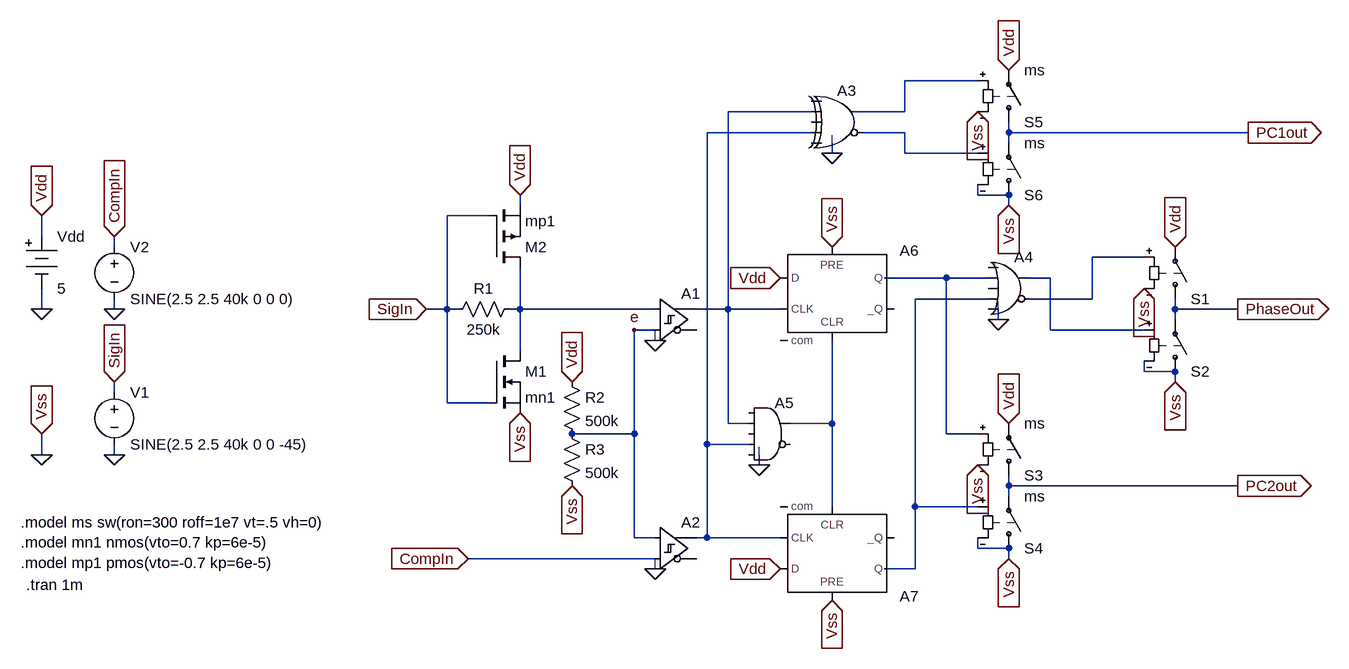
[diagram p0: schematic PhaseComp_Full.asc]
PhaseComp_Full.asc, the LTspice schematic file:
Version 4
SHEET 1 1684 680
WIRE 272 -288 160 -288
WIRE 16 -240 -112 -240
WIRE 160 -240 160 -288
WIRE 160 -240 80 -240
WIRE 16 -208 -144 -208
WIRE 160 -208 96 -208
WIRE 320 -208 320 -224
WIRE 688 -208 320 -208
WIRE 320 -192 320 -208
WIRE 48 -176 48 -192
WIRE 160 -176 160 -208
WIRE 272 -176 160 -176
WIRE 272 -112 272 -128
WIRE 320 -112 272 -112
WIRE -432 -96 -432 -112
WIRE 320 -96 320 -112
WIRE -480 -80 -544 -80
WIRE -1168 -48 -1168 -80
WIRE -1056 -32 -1056 -48
WIRE 528 -16 448 -16
WIRE 224 16 128 16
WIRE 288 16 224 16
WIRE 384 16 352 16
WIRE 288 48 176 48
WIRE 448 48 448 -16
WIRE 448 48 352 48
WIRE -1168 64 -1168 32
WIRE -1056 64 -1056 48
WIRE -544 64 -544 -80
WIRE -544 64 -576 64
WIRE -528 64 -544 64
WIRE -432 64 -432 0
WIRE -432 64 -448 64
WIRE -224 64 -432 64
WIRE -112 64 -112 -240
WIRE -112 64 -160 64
WIRE -32 64 -112 64
WIRE 576 64 576 48
WIRE 672 64 576 64
WIRE 304 80 304 64
WIRE 576 80 576 64
WIRE -224 96 -256 96
WIRE 384 96 384 16
WIRE 528 96 384 96
WIRE -432 128 -432 64
WIRE 528 160 528 144
WIRE 576 160 528 160
WIRE 576 176 576 160
WIRE -1056 192 -1056 176
WIRE -544 208 -544 64
WIRE -480 208 -544 208
WIRE -112 240 -112 64
WIRE -80 240 -112 240
WIRE 48 240 48 112
WIRE 48 240 -16 240
WIRE -256 256 -256 96
WIRE -256 256 -352 256
WIRE 224 256 224 16
WIRE 272 256 224 256
WIRE -144 272 -144 -208
WIRE -80 272 -144 272
WIRE -1168 288 -1168 256
WIRE -1056 288 -1056 272
WIRE -64 304 -64 288
WIRE 320 336 320 320
WIRE 672 336 320 336
WIRE 320 352 320 336
WIRE 48 368 48 240
WIRE 176 368 176 48
WIRE 272 368 176 368
WIRE -256 416 -256 256
WIRE -224 416 -256 416
WIRE -144 416 -144 272
WIRE -144 416 -160 416
WIRE -32 416 -144 416
WIRE 272 432 272 416
WIRE 320 432 272 432
WIRE -224 448 -512 448
WIRE 320 448 320 432
WIRE 176 464 176 368
WIRE 176 464 128 464
FLAG -256 96 e
FLAG -224 112 0
FLAG -224 464 0
FLAG -512 448 CompIn
IOPIN -512 448 In
FLAG 48 -176 0
FLAG 672 64 PhaseOut
IOPIN 672 64 Out
FLAG 576 -32 Vdd
IOPIN 576 -32 In
FLAG 528 32 Vss
IOPIN 528 32 In
FLAG 576 176 Vss
IOPIN 576 176 In
FLAG 320 240 Vdd
IOPIN 320 240 In
FLAG 272 304 Vss
IOPIN 272 304 In
FLAG 272 -240 Vss
IOPIN 272 -240 In
FLAG 672 336 PC2out
IOPIN 672 336 Out
FLAG 320 448 Vss
IOPIN 320 448 In
FLAG 688 -208 PC1out
IOPIN 688 -208 Out
FLAG 320 -304 Vdd
IOPIN 320 -304 In
FLAG 320 -96 Vss
IOPIN 320 -96 In
FLAG 304 80 0
FLAG -64 304 0
FLAG -32 16 Vdd
IOPIN -32 16 In
FLAG -32 464 Vdd
IOPIN -32 464 In
FLAG -432 224 Vss
IOPIN -432 224 In
FLAG -576 64 SigIn
IOPIN -576 64 In
FLAG -432 -112 Vdd
IOPIN -432 -112 In
FLAG 48 512 Vss
IOPIN 48 512 In
FLAG 48 -32 Vss
IOPIN 48 -32 In
FLAG -1168 256 Vss
IOPIN -1168 256 In
FLAG -1168 288 0
FLAG -1168 64 0
FLAG -1168 -80 Vdd
IOPIN -1168 -80 In
FLAG -352 176 Vdd
IOPIN -352 176 In
FLAG -352 336 Vss
IOPIN -352 336 In
FLAG -1056 176 SigIn
IOPIN -1056 176 In
FLAG -1056 288 0
FLAG -1056 64 0
FLAG -1056 -48 CompIn
IOPIN -1056 -48 In
SYMBOL Digital\\diffschmitt -224 16 R0
WINDOW 3 8 44 Invisible 2
SYMATTR Value vt=0 vh=1m td=50n
SYMATTR InstName A1
SYMBOL Digital\\diffschmitt -224 368 R0
WINDOW 3 8 44 Invisible 2
SYMATTR Value vt=0 vh=1m td=50n
SYMATTR InstName A2
SYMBOL Digital\\xor 64 -288 R0
SYMATTR InstName A3
SYMBOL sw 576 64 M180
WINDOW 3 24 96 Invisible 2
SYMATTR Value ms
SYMATTR InstName S1
SYMBOL sw 576 176 M180
WINDOW 3 24 96 Invisible 2
SYMATTR Value ms
SYMATTR InstName S2
SYMBOL sw 320 336 M180
SYMATTR InstName S3
SYMATTR Value ms
SYMBOL sw 320 448 M180
SYMATTR InstName S4
SYMATTR Value ms
SYMBOL sw 320 -208 M180
SYMATTR InstName S5
SYMATTR Value ms
SYMBOL sw 320 -96 M180
SYMATTR InstName S6
SYMATTR Value ms
SYMBOL Digital\\or 320 -32 R0
SYMATTR InstName A4
SYMBOL Digital\\and -48 192 R0
SYMATTR InstName A5
SYMBOL Digital\\dflop 48 -32 R0
SYMATTR InstName A6
SYMBOL Digital\\dflop 48 512 M180
SYMATTR InstName A7
SYMBOL nmos -480 128 R0
SYMATTR InstName M1
SYMATTR Value mn1
SYMBOL pmos -480 0 M180
SYMATTR InstName M2
SYMATTR Value mp1
SYMBOL res -432 48 R90
WINDOW 0 0 56 VBottom 2
WINDOW 3 32 56 VTop 2
SYMATTR InstName R1
SYMATTR Value 250k
SYMBOL Misc\\battery -1168 -64 R0
WINDOW 123 0 0 Left 0
WINDOW 39 0 0 Left 0
SYMATTR InstName Vdd
SYMATTR Value 5
SYMBOL res -368 160 R0
SYMATTR InstName R2
SYMATTR Value 500k
SYMBOL res -368 240 R0
SYMATTR InstName R3
SYMATTR Value 500k
SYMBOL voltage -1056 176 R0
WINDOW 123 0 0 Left 0
WINDOW 39 0 0 Left 0
SYMATTR InstName V1
SYMATTR Value SINE(2.5 2.5 40k 0 0 -45)
SYMBOL voltage -1056 -48 R0
WINDOW 123 0 0 Left 0
WINDOW 39 0 0 Left 0
SYMATTR InstName V2
SYMATTR Value SINE(2.5 2.5 40k 0 0 0)
TEXT -1192 488 Left 2 !.tran 1m
TEXT -1200 392 Left 2 !.model ms sw(ron=300 roff=1e7 vt=.5 vh=0)\n.model mn1 nmos(vto=0.7 kp=6e-5)\n.model mp1 pmos(vto=-0.7 kp=6e-5)

The netlist it stands for:
* PhaseComp_Full.asc
A1 N009 e 0 0 0 0 N002 0 SCHMITT vt=0 vh=1m td=50n
A2 e CompIn 0 0 0 0 N003 0 SCHMITT vt=0 vh=1m td=50n
A3 0 N002 0 N003 0 N004 N001 0 XOR
S1 PhaseOut Vdd N005 0 ms
S2 0 PhaseOut N007 0 ms
S3 PC2out Vdd N006 0 ms
S4 0 PC2out N008 0 ms
S5 PC1out Vdd N001 0 ms
S6 0 PC1out N004 0 ms
A4 0 N006 0 N008 0 N005 N007 0 OR
A5 0 N002 0 N003 0 0 N010 0 AND
A6 Vdd 0 N002 0 N010 0 N006 0 DFLOP
A7 Vdd 0 N003 0 N010 0 N008 0 DFLOP
M1 N009 SigIn 0 0 mn1
M2 N009 SigIn Vdd Vdd mp1
R1 N009 SigIn 250k
Vdd Vdd 0 5
R2 Vdd e 500k
R3 e 0 500k
V1 SigIn 0 SINE(2.5 2.5 40k 0 0 -45)
V2 CompIn 0 SINE(2.5 2.5 40k 0 0 0)
.model NMOS NMOS
.model PMOS PMOS
.lib standard.mos
.tran 1m
.model ms sw(ron=300 roff=1e7 vt=.5 vh=0)
.model mn1 nmos(vto=0.7 kp=6e-5)
.model mp1 pmos(vto=-0.7 kp=6e-5)
.backanno
.end